# EAGLE schematic MT3620 grove breakout v1.0 (EAGLE 9.3.0)
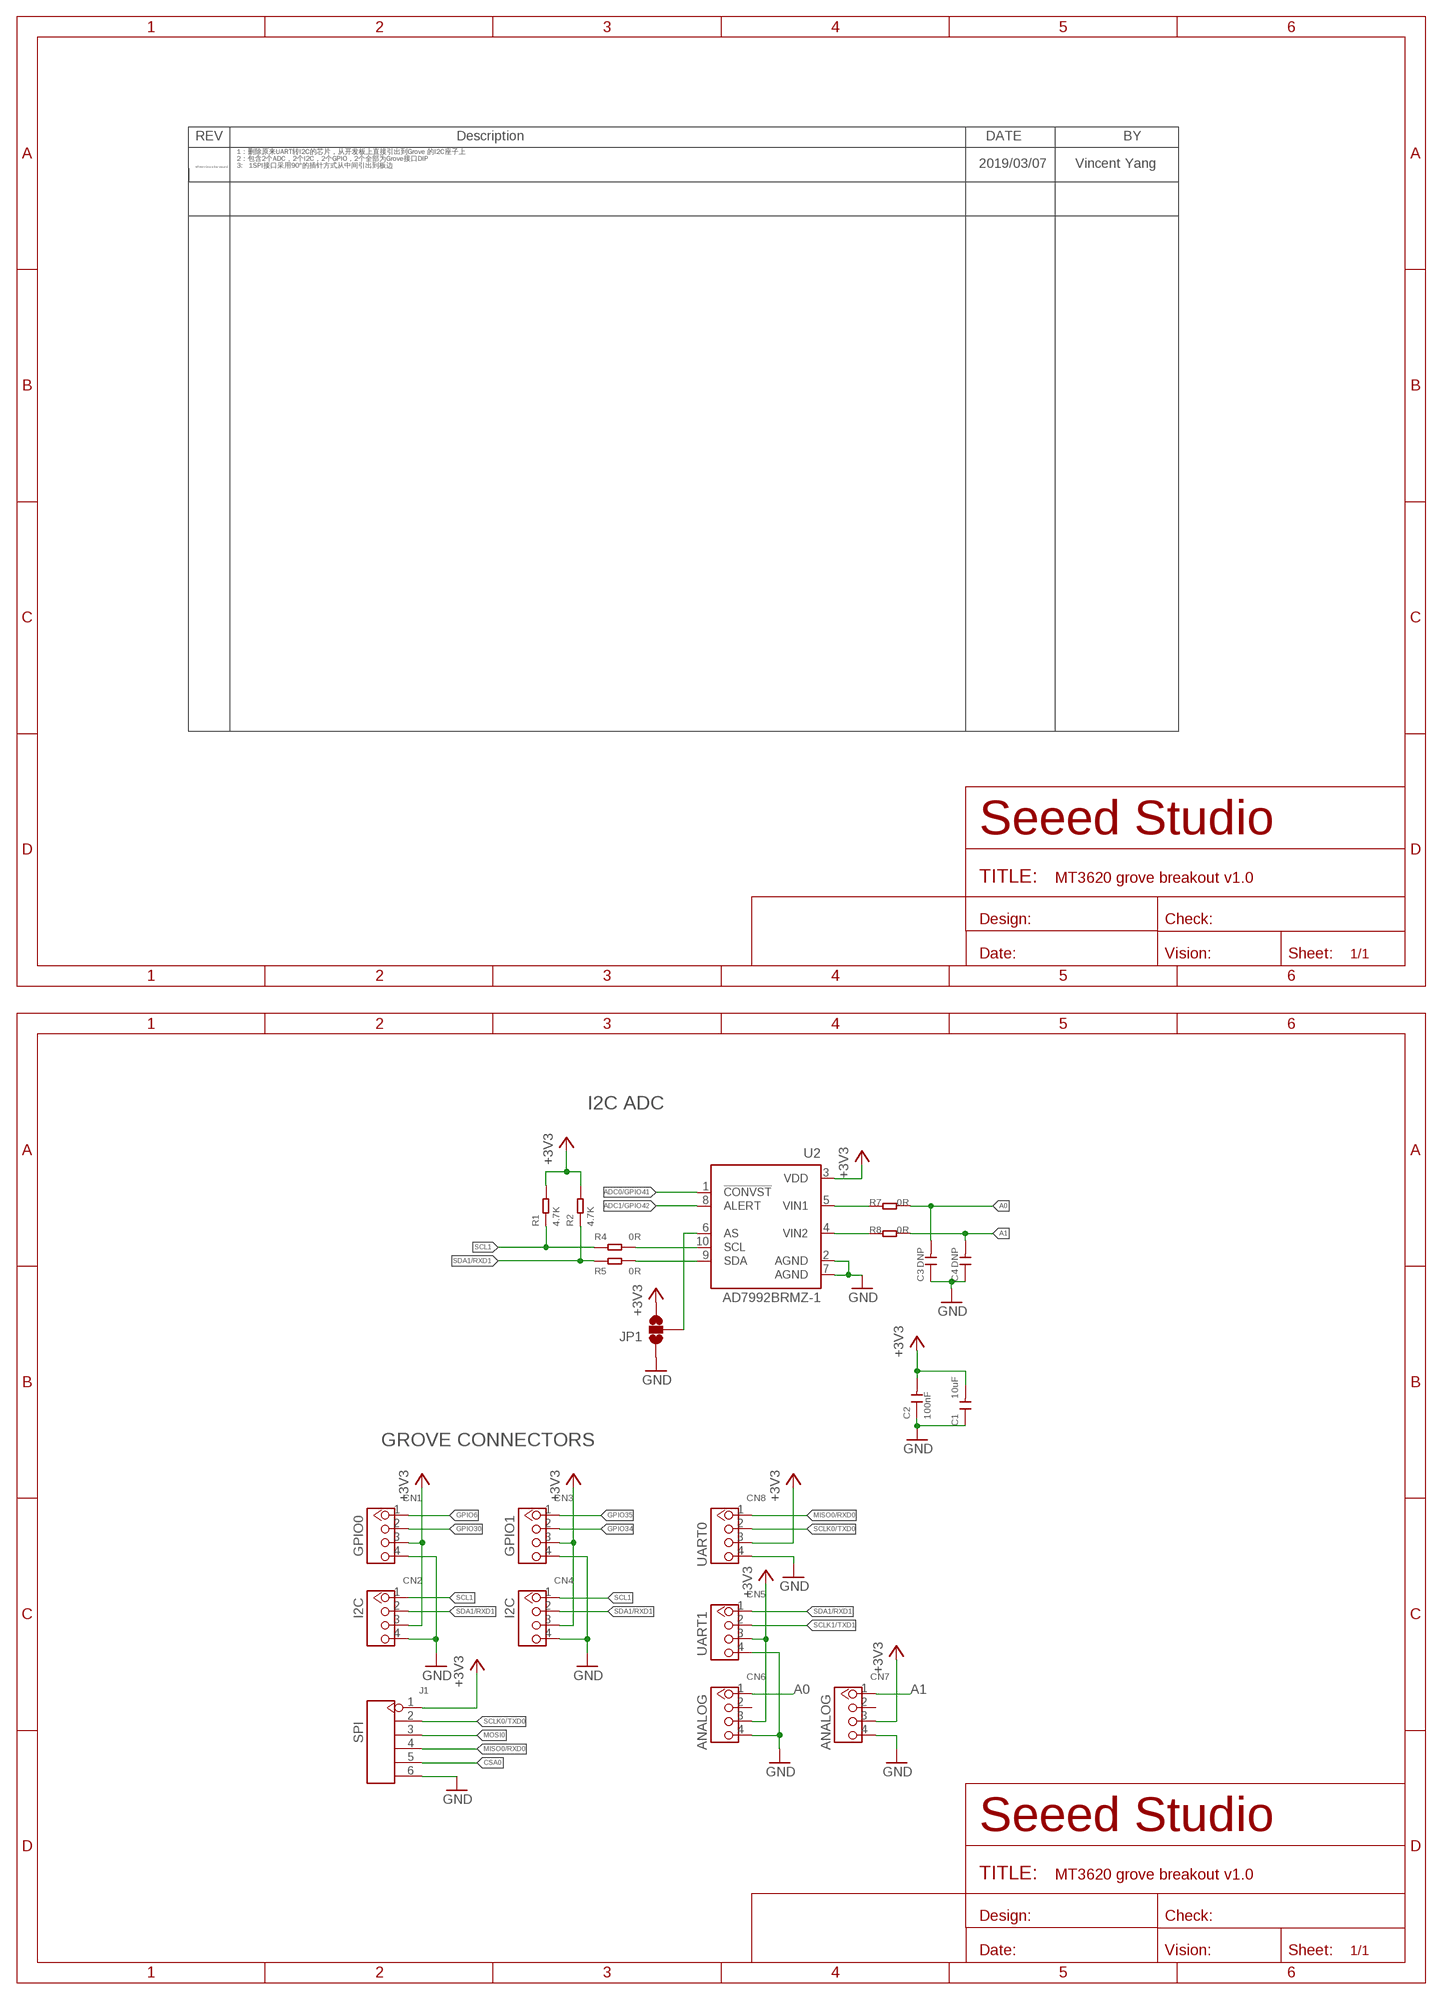
[diagram p0: schematic, sheet 1, part 1 of 2]
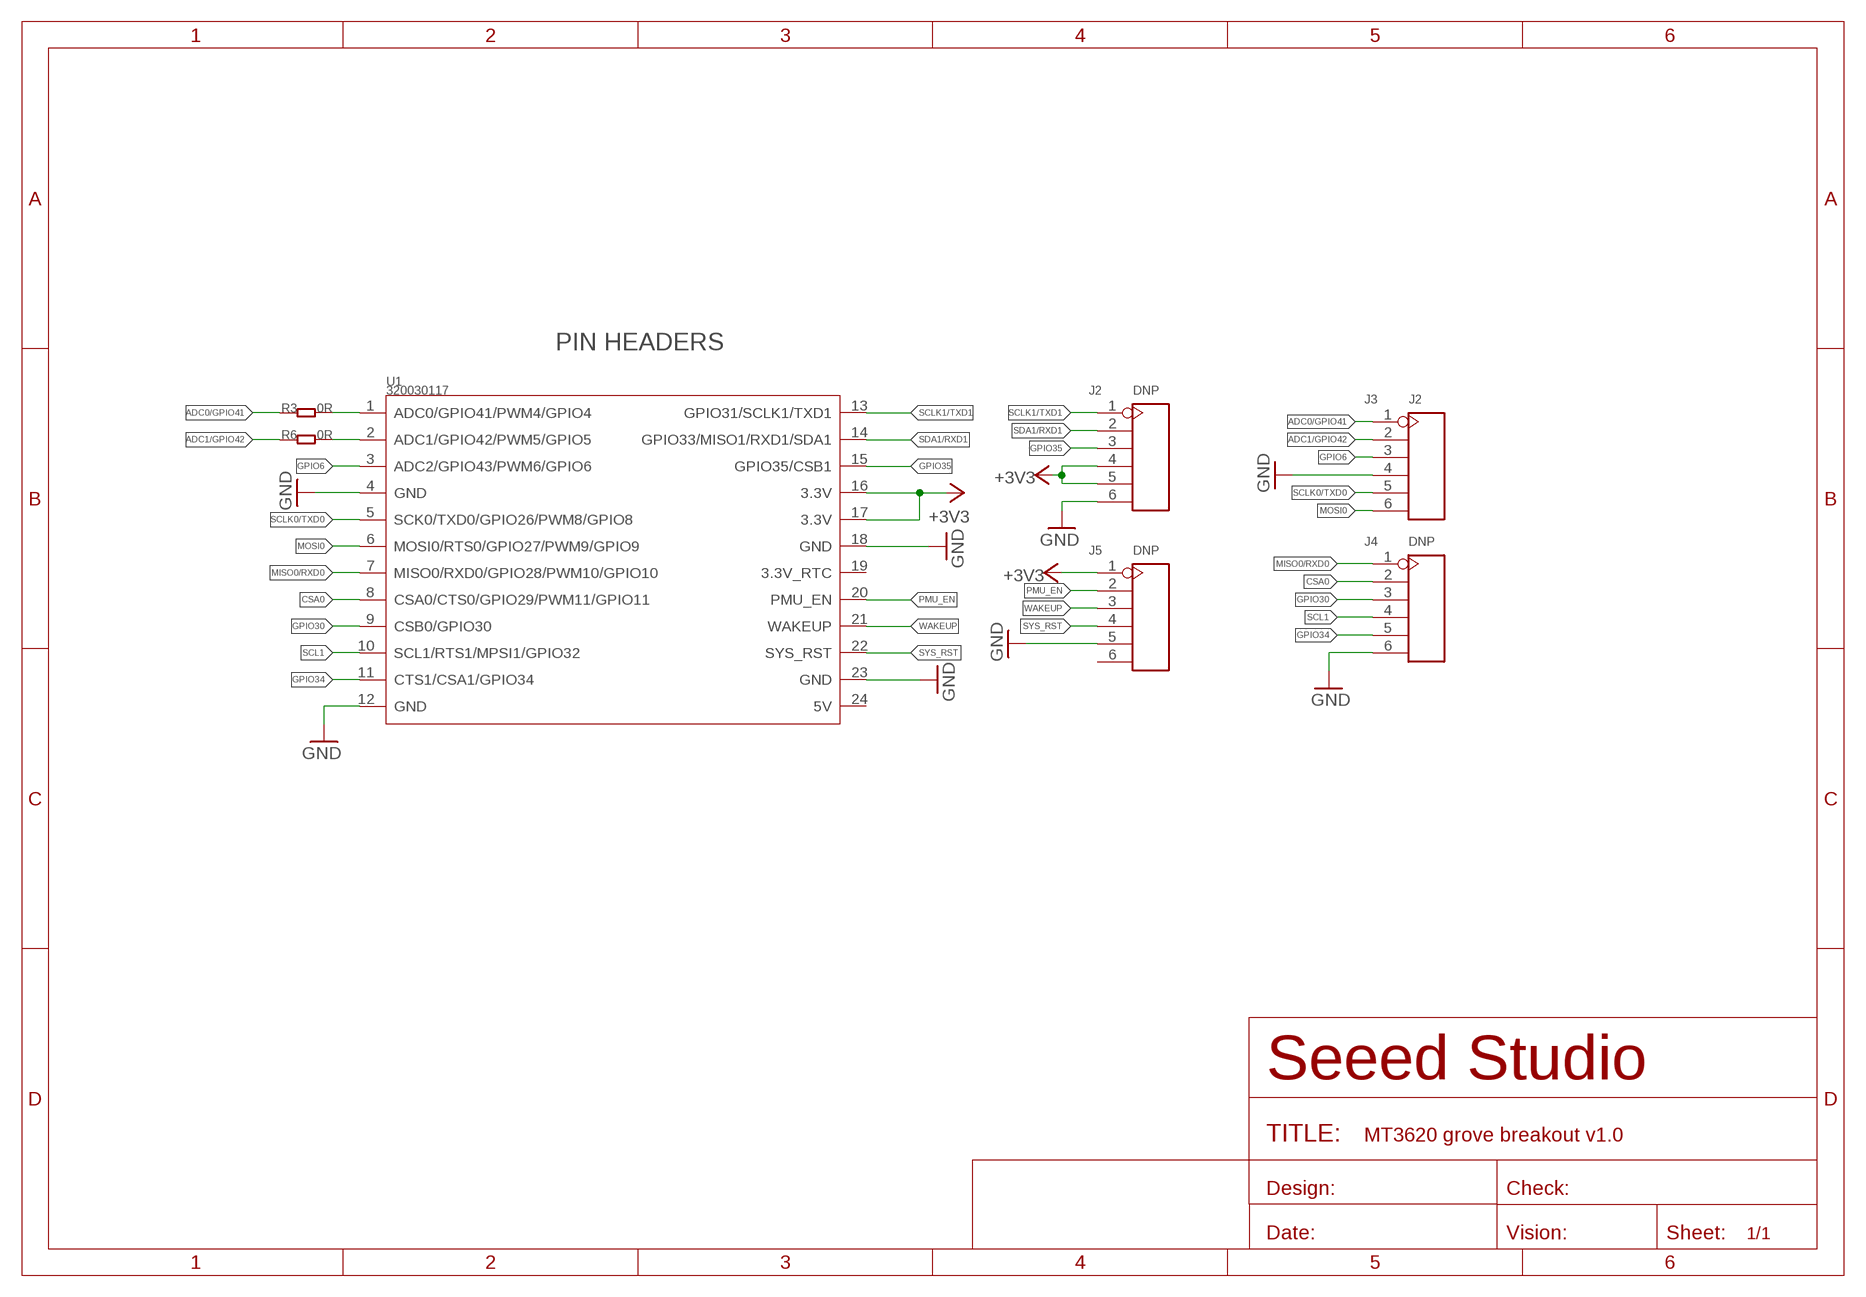
[diagram p1: schematic, sheet 1, part 2 of 2]

## Parts
C1  10uF  CAP-0603  [C0603]
C2  100nF  CAP-0603  [C0603]
C3  DNP  CAP-0603  [C0603]
C4  DNP  CAP-0603  [C0603]
CN1  320110033  GROVE-CONNECTOR-DIP(4P-2.0)  [HW4-2.0]
CN2  320110033  GROVE-CONNECTOR-DIP(4P-2.0)  [HW4-2.0]
CN3  320110033  GROVE-CONNECTOR-DIP(4P-2.0)  [HW4-2.0]
CN4  320110033  GROVE-CONNECTOR-DIP(4P-2.0)  [HW4-2.0]
CN5  320110033  GROVE-CONNECTOR-DIP(4P-2.0)  [HW4-2.0]
CN6  320110033  GROVE-CONNECTOR-DIP(4P-2.0)  [HW4-2.0]
CN7  320110033  GROVE-CONNECTOR-DIP(4P-2.0)  [HW4-2.0]
CN8  320110033  GROVE-CONNECTOR-DIP(4P-2.0)  [HW4-2.0]
J1  320020019  HEADER-6P-55/35MIL  [H6-2.54]
J2  DNP  HEADER-6P-55/35MIL  [H6-2.54]
J3  J2  HEADER-6P-55/35MIL  [H6-2.54]
J4  DNP  HEADER-6P-55/35MIL  [H6-2.54]
J5  DNP  HEADER-6P-55/35MIL  [H6-2.54]
JP1  JUMPER-SMT_3_NO_SILK  [SMT-JUMPER_3_NO_SILK]
R1  4.7K  RES-0603  [R0603]
R2  4.7K  RES-0603  [R0603]
R3  0R  RES-0603  [R0603]
R4  0R  RES-0603  [R0603]
R5  0R  RES-0603  [R0603]
R6  0R  RES-0603  [R0603]
R7  0R  RES-0603  [R0603]
R8  0R  RES-0603  [R0603]
U1  320030117  MT3620-DEV-BOARD  [MT3620-DEV-BOARD]
U2  AD7992BRMZ-1  AD7992  [MSOP10]

## Nets
+3V3: C1.2 C2.2 CN1.3 CN2.3 CN3.3 CN4.3 CN5.3 CN6.3 CN7.3 CN8.3 J1.1 J2.4 J2.5 J5.1 JP1.1 R1.2 R2.2 U1.16(3.3V) U1.17(3.3V) U2.3(VDD)
A0: C3.2 CN6.1 R7.2
A1: C4.2 CN7.1 R8.2
ADC0/GPIO41: J3.1 R3.2 U2.1(!CONVST)
ADC1/GPIO42: J3.2 R6.2 U2.8(ALERT)
CSA0: J1.5 J4.2 U1.8(CSA0/CTS0/GPIO29/PWM11/GPIO11)
GND: C1.1 C2.1 C3.1 C4.1 CN1.4 CN2.4 CN3.4 CN4.4 CN5.4 CN6.4 CN7.4 CN8.4 J1.6 J2.6 J3.4 J4.6 J5.5 JP1.3 U1.4(GND) U1.12(GND) U1.18(GND) U1.23(GND) U2.2(AGND) U2.7(AGND)
GPIO6: CN1.1 J3.3 U1.3(ADC2/GPIO43/PWM6/GPIO6)
GPIO30: CN1.2 J4.3 U1.9(CSB0/GPIO30)
GPIO34: CN3.2 J4.5 U1.11(CTS1/CSA1/GPIO34)
GPIO35: CN3.1 J2.3 U1.15(GPIO35/CSB1)
MISO0/RXD0: CN8.1 J1.4 J4.1 U1.7(MISO0/RXD0/GPIO28/PWM10/GPIO10)
MOSI0: J1.3 J3.6 U1.6(MOSI0/RTS0/GPIO27/PWM9/GPIO9)
N$1: R5.2 U2.9(SDA)
N$2: R4.2 U2.10(SCL)
N$3: JP1.2 U2.6(AS)
N$4: R7.1 U2.5(VIN1)
N$5: R8.1 U2.4(VIN2)
N$34: R3.1 U1.1(ADC0/GPIO41/PWM4/GPIO4)
N$44: R6.1 U1.2(ADC1/GPIO42/PWM5/GPIO5)
PMU_EN: J5.2 U1.20(PMU_EN)
SCL1: CN2.1 CN4.1 J4.4 R1.1 R4.1 U1.10(SCL1/RTS1/MPSI1/GPIO32)
SCLK0/TXD0: CN8.2 J1.2 J3.5 U1.5(SCK0/TXD0/GPIO26/PWM8/GPIO8)
SCLK1/TXD1: CN5.2 J2.1 U1.13(GPIO31/SCLK1/TXD1)
SDA1/RXD1: CN2.2 CN4.2 CN5.1 J2.2 R2.1 R5.1 U1.14(GPIO33/MISO1/RXD1/SDA1)
SYS_RST: J5.4 U1.22(SYS_RST)
WAKEUP: J5.3 U1.21(WAKEUP)
Unconnected: CN6.2 CN7.2 J5.6 U1.19(3.3V_RTC) U1.24(5V)

## Notes on the sheet
- 1：删除原来UART转I2C的芯片，从开发板上直接引出到Grove 的I2C座子上
- 2：包含2个ADC，2个I2C，2个GPIO，2个全部为Grove接口DIP
- MT3620 Grove Berakout V1 | 3:   1SPI接口采用90°的插针方式从中间引出到板边 | 2019/03/07 | Vincent Yang
- I2C ADC
- GROVE CONNECTORS
- GPIO0 | GPIO1
- UART0
- I2C | I2C
- UART1
- ANALOG | ANALOG
- SPI
- PIN HEADERS

## Library data of the parts
C1-C4 = Discrete-new:CAP: Ceramic Capacitors
CN1-CN8 = Seeed-Connector:GROVE-CONNECTOR-DIP(4P-2.0): 320110033; VALUE: 4P-2.0
J1-J5 = Connector-new:HEADER-6P
JP1 = SparkFun-Jumpers:JUMPER-SMT_3_NO: Normally open jumper This jumper has three pads in close proximity to each other. Apply solder to close the connection(s).
R1-R8 = Discrete-new:RES
U1 = moudle-new:MT3620-DEV-BOARD
U2 = kanflo:AD7992: 2-Channel, 12-Bit ADC with I2C-Compatible Interface 10-Lead MSOP Source: http://www.analog.com/UploadedFiles/Data_Sheets/224965274AD7992_0.pdf; MPN: AD7992BRMZ-0; OC_FARNELL: 1078311; OC_NEWARK: 31M4422